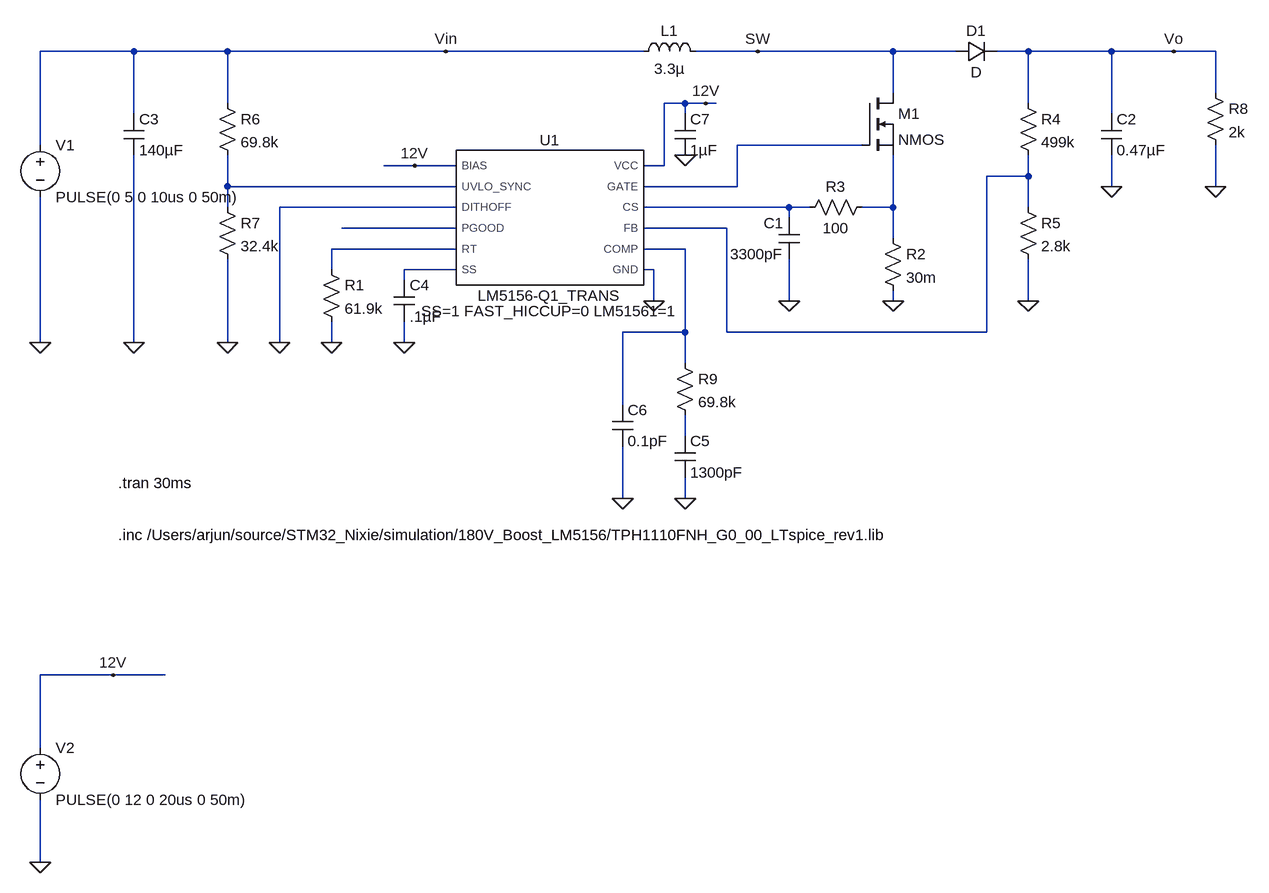
[diagram p0: schematic 180V_boost_LM5156_Scratch.asc]
180V_boost_LM5156_Scratch.asc, the LTspice schematic file:
Version 4
SHEET 1 1476 1344
WIRE -240 80 -384 80
WIRE -96 80 -240 80
WIRE 240 80 -96 80
WIRE 544 80 240 80
WIRE 720 80 624 80
WIRE 928 80 720 80
WIRE 1024 80 928 80
WIRE 1136 80 1088 80
WIRE 1264 80 1136 80
WIRE 1360 80 1264 80
WIRE 1424 80 1360 80
WIRE 928 144 928 80
WIRE 1424 144 1424 80
WIRE -96 160 -96 80
WIRE 608 160 576 160
WIRE 640 160 608 160
WIRE 656 160 640 160
WIRE 1136 160 1136 80
WIRE -240 176 -240 80
WIRE 608 176 608 160
WIRE 1264 176 1264 80
WIRE -384 224 -384 80
WIRE 880 224 688 224
WIRE 192 256 144 256
WIRE 256 256 192 256
WIRE 576 256 576 160
WIRE 576 256 544 256
WIRE 1136 272 1136 240
WIRE 1136 272 1072 272
WIRE -96 288 -96 240
WIRE 256 288 -96 288
WIRE 688 288 688 224
WIRE 688 288 544 288
WIRE 1264 288 1264 240
WIRE 1424 288 1424 224
WIRE -96 320 -96 288
WIRE 256 320 -16 320
WIRE 768 320 544 320
WIRE 800 320 768 320
WIRE 928 320 928 240
WIRE 928 320 880 320
WIRE 1136 320 1136 272
WIRE 768 336 768 320
WIRE 256 352 80 352
WIRE 672 352 544 352
WIRE 928 368 928 320
WIRE 256 384 64 384
WIRE 608 384 544 384
WIRE 64 416 64 384
WIRE 256 416 176 416
WIRE 560 416 544 416
WIRE 176 432 176 416
WIRE 560 464 560 416
WIRE 768 464 768 400
WIRE 928 464 928 448
WIRE 1136 464 1136 400
WIRE 608 512 608 384
WIRE 608 512 512 512
WIRE 672 512 672 352
WIRE 1072 512 1072 272
WIRE 1072 512 672 512
WIRE -384 528 -384 304
WIRE -240 528 -240 240
WIRE -96 528 -96 400
WIRE -16 528 -16 320
WIRE 64 528 64 496
WIRE 176 528 176 496
WIRE 608 560 608 512
WIRE 512 624 512 512
WIRE 608 672 608 640
WIRE 512 768 512 688
WIRE 608 768 608 736
WIRE -272 1040 -384 1040
WIRE -192 1040 -272 1040
WIRE -384 1152 -384 1040
WIRE -384 1328 -384 1232
FLAG 64 528 0
FLAG 560 464 0
FLAG 768 464 0
FLAG 928 464 0
FLAG 1136 464 0
FLAG 1264 288 0
FLAG 176 528 0
FLAG -16 528 0
FLAG -96 528 0
FLAG -240 528 0
FLAG 608 768 0
FLAG 512 768 0
FLAG -384 528 0
FLAG 1424 288 0
FLAG 1360 80 Vo
FLAG 720 80 SW
FLAG 240 80 Vin
FLAG 608 240 0
FLAG -384 1328 0
FLAG -272 1040 12V
FLAG 192 256 12V
FLAG 640 160 12V
SYMBOL Res 48 400 R0
SYMATTR InstName R1
SYMATTR Value 61.9k
SYMBOL Res 912 352 R0
SYMATTR InstName R2
SYMATTR Value 30m
SYMBOL Cap 784 400 R180
WINDOW 0 24 56 Left 2
WINDOW 3 24 8 Left 2
SYMATTR InstName C1
SYMATTR Value 3300pF
SYMBOL Res 896 304 R90
WINDOW 0 0 56 VBottom 2
WINDOW 3 32 56 VTop 2
SYMATTR InstName R3
SYMATTR Value 100
SYMBOL ind 528 96 R270
WINDOW 0 32 56 VTop 2
WINDOW 3 5 56 VBottom 2
SYMATTR InstName L1
SYMATTR Value 3.3µ
SYMATTR SpiceLine Rser=10m
SYMBOL Diode 1024 96 R270
WINDOW 0 32 32 VTop 2
WINDOW 3 0 32 VBottom 2
SYMATTR InstName D1
SYMBOL Cap 1248 176 R0
SYMATTR InstName C2
SYMATTR Value 0.47µF
SYMBOL Res 1120 144 R0
SYMATTR InstName R4
SYMATTR Value 499k
SYMBOL Res 1120 304 R0
SYMATTR InstName R5
SYMATTR Value 2.8k
SYMBOL Cap -256 176 R0
SYMATTR InstName C3
SYMATTR Value 140µF
SYMBOL Cap 160 432 R0
SYMATTR InstName C4
SYMATTR Value .1µF
SYMBOL Res -112 144 R0
SYMATTR InstName R6
SYMATTR Value 69.8k
SYMBOL Res -112 304 R0
SYMATTR InstName R7
SYMATTR Value 32.4k
SYMBOL Res 592 544 R0
SYMATTR InstName R9
SYMATTR Value 69.8k
SYMBOL Cap 592 672 R0
SYMATTR InstName C5
SYMATTR Value 1300pF
SYMBOL Cap 496 624 R0
SYMATTR InstName C6
SYMATTR Value 0.1pF
SYMBOL Voltage -384 208 R0
SYMATTR InstName V1
SYMATTR Value PULSE(0 5 0 10us 0 50m)
SYMATTR SpiceLine Rser=1m
SYMBOL Res 1408 128 R0
SYMATTR InstName R8
SYMATTR Value 2k
SYMBOL Cap 592 176 R0
SYMATTR InstName C7
SYMATTR Value 1µF
SYMBOL nmos 880 144 R0
SYMATTR InstName M1
SYMBOL LM5156-Q1_TRANS 400 336 R0
SYMATTR InstName U1
SYMATTR SpiceLine SS=1 FAST_HICCUP=0 LM51561=1
SYMBOL Voltage -384 1136 R0
SYMATTR InstName V2
SYMATTR Value PULSE(0 12 0 20us 0 50m)
SYMATTR SpiceLine Rser=1m
TEXT -264 824 Left 2 !.inc /Users/arjun/source/STM32_Nixie/simulation/180V_Boost_LM5156/TPH1110FNH_G0_00_LTspice_rev1.lib
TEXT -264 744 Left 2 !.tran 30ms

The netlist it stands for:
* 180V_boost_LM5156_Scratch.asc
R1 N007 0 61.9k
R2 N005 0 30m
C1 0 N004 3300pF
R3 N005 N004 100
L1 Vin SW 3.3µ Rser=10m
D1 SW Vo D
C2 Vo 0 0.47µF
R4 Vo N002 499k
R5 N002 0 2.8k
C3 Vin 0 140µF
C4 N009 0 .1µF
R6 Vin N003 69.8k
R7 N003 0 32.4k
R9 N008 N010 69.8k
C5 N010 0 1300pF
C6 N008 0 0.1pF
V1 Vin 0 PULSE(0 5 0 10us 0 50m) Rser=1m
R8 Vo 0 2k
C7 12V 0 1µF
M1 SW N001 N005 N005 NMOS
XU1 12V N008 N004 0 N002 N001 0 N006 N007 N009 N003 12V LM5156-Q1_TRANS SS=1 FAST_HICCUP=0 LM51561=1  ; pins BIAS COMP CS DITHOFF FB GATE GND PGOOD RT SS UVLO_SYNC VCC
V2 12V 0 PULSE(0 12 0 20us 0 50m) Rser=1m
.model D D
.lib standard.dio
.model NMOS NMOS
.model PMOS PMOS
.lib standard.mos
.inc /Users/arjun/source/STM32_Nixie/simulation/180V_Boost_LM5156/TPH1110FNH_G0_00_LTspice_rev1.lib
.tran 30ms
.lib /Users/arjun/source/STM32_Nixie/simulation/180V_Boost_LM5156/LM5156-Q1_PSPICE_TRANS/LM5156-Q1_TRANS.LIB
.backanno
.end